# Altium schematic sheet Temperarute_Sensing_Module.SchDoc
size A4
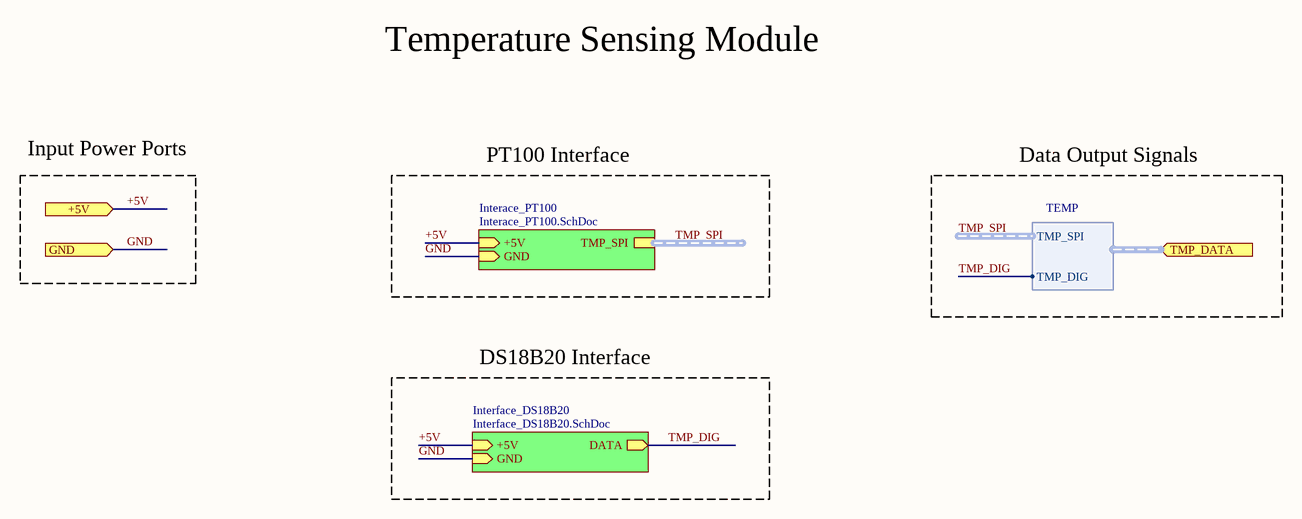
[diagram p0: Temperarute_Sensing_Module.SchDoc]

## Sub-sheets
Interace_PT100 = Interace_PT100.SchDoc: GND (in), +5V (in), TMP_SPI (harness TMP_SPI)
Interface_DS18B20 = Interface_DS18B20.SchDoc: GND (in), +5V (in), DATA (out)

## Ports
+5V (in), GND (in), TMP_DATA (in, harness TEMP)

## Harnesses
TEMP: TMP_SPI, TMP_DIG

## Nets
+5V: port +5V, sheet Interace_PT100/+5V, sheet Interface_DS18B20/+5V
GND: port GND, sheet Interace_PT100/GND, sheet Interface_DS18B20/GND
TMP_DIG: sheet Interface_DS18B20/DATA, port TMP_DATA.TMP_DIG

## Buses and harness runs
harness TMP_SPI = sheet Interace_PT100/TMP_SPI

## Notes on the sheet
- Temperature Sensing Module
- Input Power Ports
- PT100 Interface
- Data Output Signals
- DS18B20 Interface